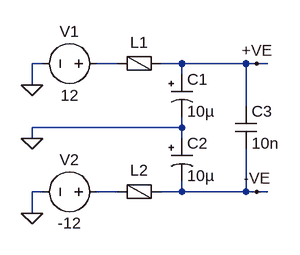
[diagram p0: schematic Draft1.asc]
Draft1.asc, the LTspice schematic file:
Version 4
SHEET 1 880 680
WIRE 96 160 80 160
WIRE 208 160 176 160
WIRE 304 160 272 160
WIRE 400 160 304 160
WIRE 416 160 400 160
WIRE 432 160 416 160
WIRE 304 176 304 160
WIRE 80 192 80 160
WIRE 400 224 400 160
WIRE 304 256 304 240
WIRE 304 256 80 256
WIRE 80 272 80 256
WIRE 304 272 304 256
WIRE 96 352 80 352
WIRE 208 352 176 352
WIRE 304 352 304 336
WIRE 304 352 272 352
WIRE 400 352 400 288
WIRE 400 352 304 352
WIRE 416 352 400 352
WIRE 432 352 416 352
WIRE 80 384 80 352
FLAG 80 192 0
FLAG 80 384 0
FLAG 80 272 0
FLAG 416 160 +VE
FLAG 416 352 -VE
SYMBOL voltage 192 160 R90
WINDOW 0 -32 56 VBottom 2
WINDOW 3 32 56 VTop 2
SYMATTR InstName V1
SYMATTR Value 12
SYMBOL voltage 192 352 R90
WINDOW 0 -32 56 VBottom 2
WINDOW 3 32 56 VTop 2
SYMATTR InstName V2
SYMATTR Value -12
SYMBOL FerriteBead 240 160 R90
WINDOW 0 -16 0 VBottom 2
SYMATTR InstName L1
SYMBOL FerriteBead 240 352 R90
WINDOW 0 -16 0 VBottom 2
SYMATTR InstName L2
SYMBOL polcap 288 176 R0
WINDOW 3 24 56 Left 2
SYMATTR InstName C1
SYMATTR Value 10µ
SYMATTR Description Capacitor
SYMATTR Type cap
SYMATTR SpiceLine Rser=1.4 Lser=0 mfg="Nichicon" pn="UPL1H100MAH" type="Al electrolytic"
SYMBOL polcap 288 272 R0
WINDOW 3 24 56 Left 2
SYMATTR InstName C2
SYMATTR Value 10µ
SYMATTR Description Capacitor
SYMATTR Type cap
SYMATTR SpiceLine Rser=1.4 Lser=0 mfg="Nichicon" pn="UPL1H100MAH" type="Al electrolytic"
SYMBOL cap 384 224 R0
SYMATTR InstName C3
SYMATTR Value 10n

The netlist it stands for:
* Draft1.asc
V1 N001 0 12
V2 N002 0 -12
L1 +VE N001
L2 -VE N002
C1 +VE 0 10µ Rser=1.4 Lser=0 mfg="Nichicon" pn="UPL1H100MAH" type="Al electrolytic"
C2 0 -VE 10µ Rser=1.4 Lser=0 mfg="Nichicon" pn="UPL1H100MAH" type="Al electrolytic"
C3 +VE -VE 10n
.backanno
.end